# Altium schematic sheet SENSOR.SchDoc
size A4
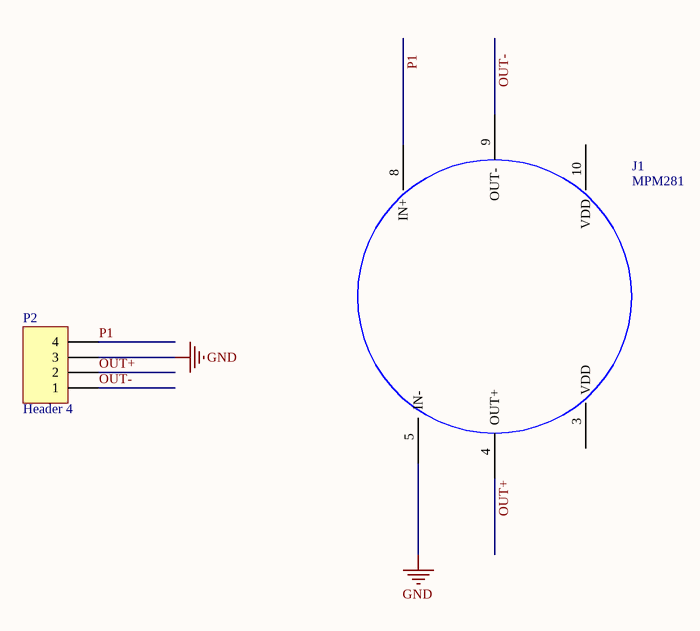
[diagram p0: SENSOR.SchDoc]

## Parts
J1  MPM281  [MPM281]
P2  Header 4  [HDR1X4]

## Nets
GND: J1.5(IN-) P2.3
OUT+: J1.4(OUT+) P2.2
OUT-: J1.9(OUT-) P2.1
P1: J1.8(IN+) P2.4

Not connected (* = marked no-connect by the designer): J1 3(VDD) 10(VDD)

## Library data of the parts
P2 = Header 4: Header, 4-Pin; LatestRevisionDate: 17-Jul-2002; LatestRevisionNote: Re-released for DXP Platform.; Publisher: Altium Limited